# EAGLE design rrfdc (EAGLE 6.4)
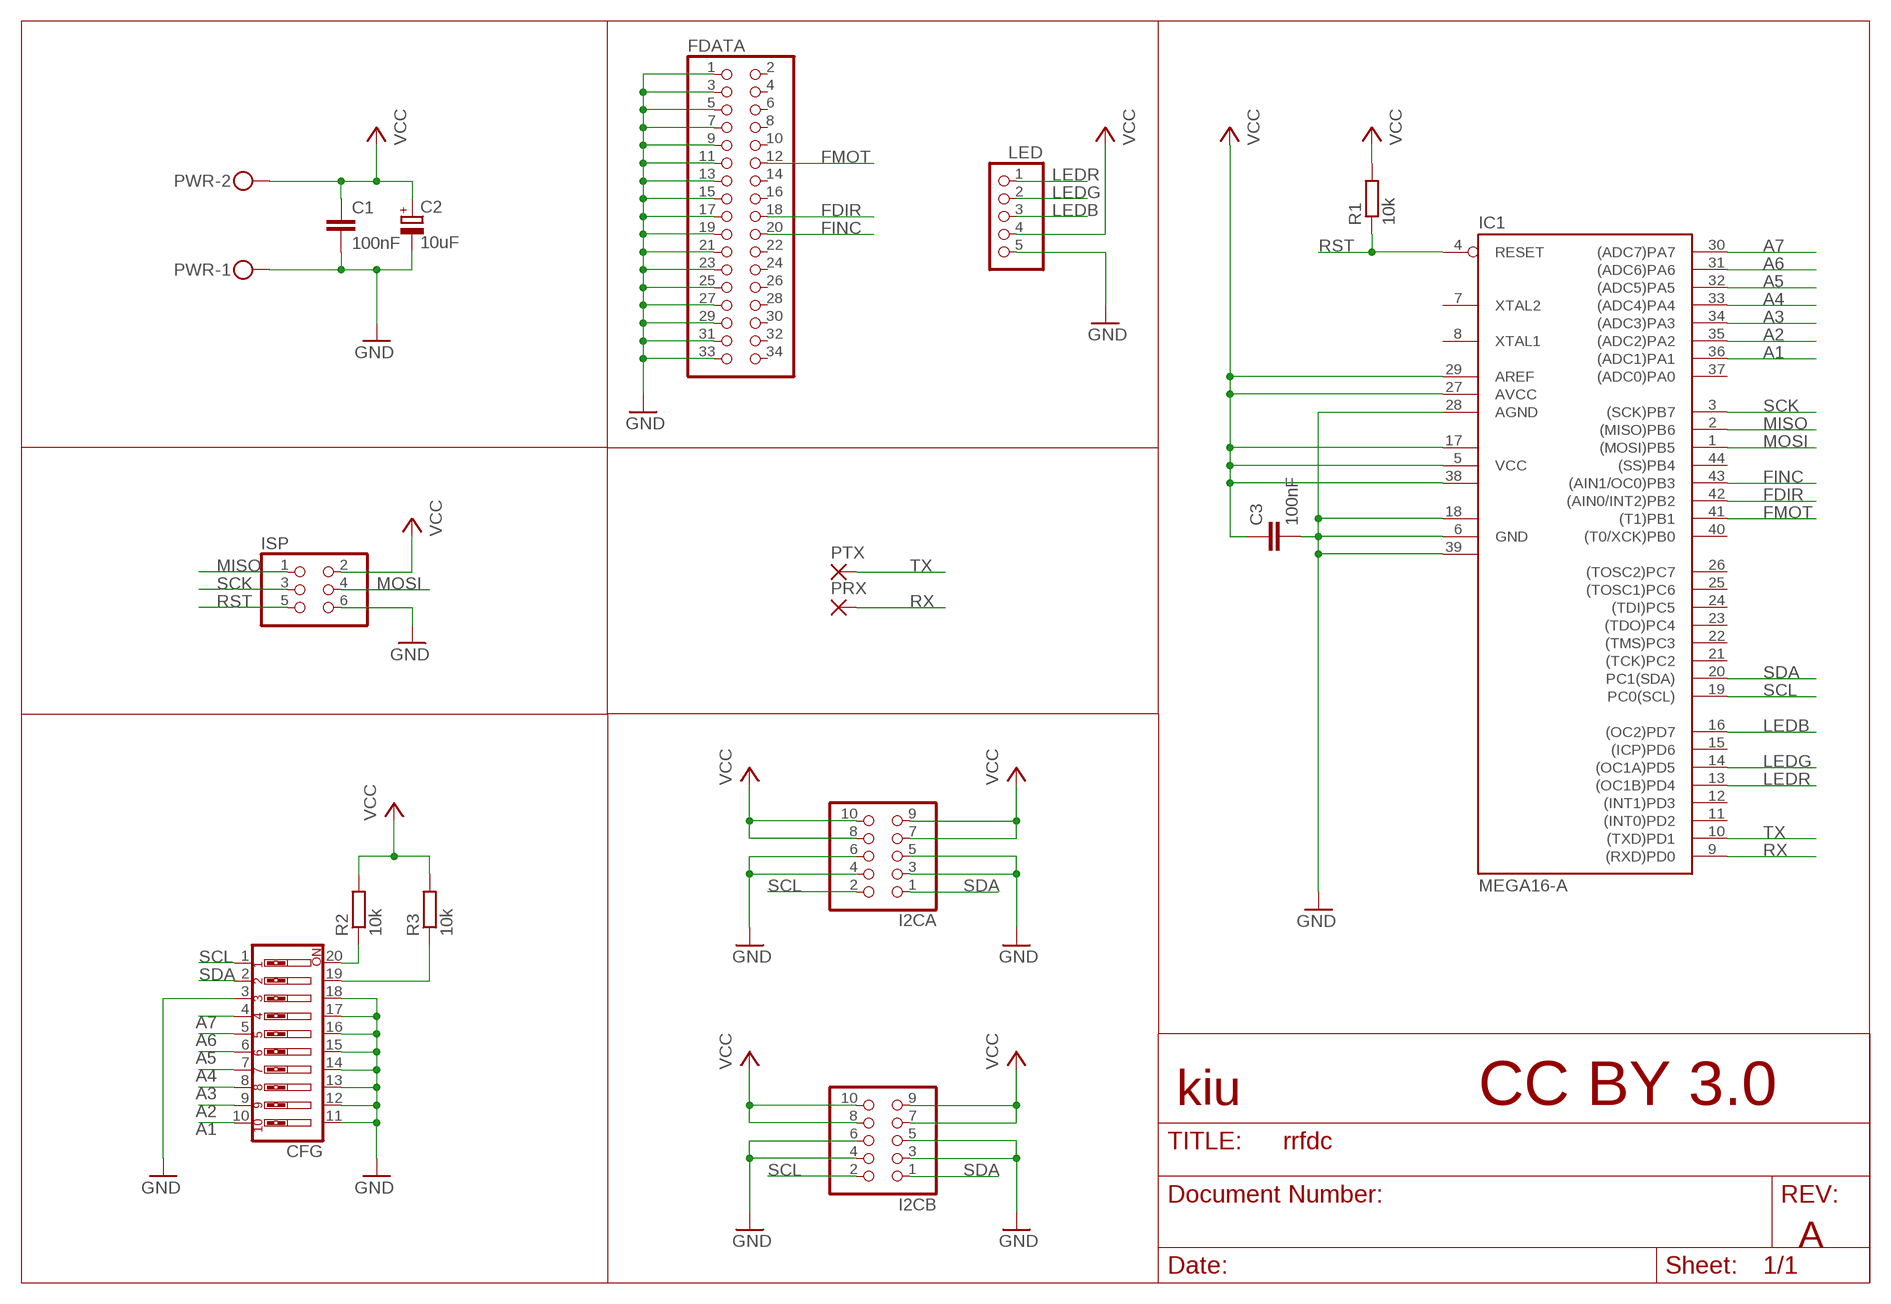
[diagram p0: schematic, sheet 1]

## Parts
C1  100nF  C-EUC0805  [C0805]
C2  10uF  CPOL-EUCT3216  [CT3216]
C3  100nF  C-EUC0805  [C0805]
CFG  SW_DIP-10  [EDG-10]
FDATA  PINHD-2X17  [2X17]
I2CA  PINHD-2X5  [2X05]
I2CB  PINHD-2X5  [2X05]
IC1  MEGA16-A  [TQFP44]
ISP  PINHD-2X3  [2X03]
LED  PINHD-1X5  [1X05]
PRX  SMD2  [SMD1,27-2,54]
PTX  SMD2  [SMD1,27-2,54]
PWR  MKDSN1,5/2-5,08  [MKDSN1,5/2-5,08]
R1  10k  R-EU_R0805  [R0805]
R2  10k  R-EU_R0805  [R0805]
R3  10k  R-EU_R0805  [R0805]

## Nets
A1: CFG.10 IC1.36((ADC1)PA1)
A2: CFG.9 IC1.35((ADC2)PA2)
A3: CFG.8 IC1.34((ADC3)PA3)
A4: CFG.7 IC1.33((ADC4)PA4)
A5: CFG.6 IC1.32((ADC5)PA5)
A6: CFG.5 IC1.31((ADC6)PA6)
A7: CFG.4 IC1.30((ADC7)PA7)
FDIR: FDATA.18 IC1.42((AIN0/INT2)PB2)
FINC: FDATA.20 IC1.43((AIN1/OC0)PB3)
FMOT: FDATA.12 IC1.41((T1)PB1)
GND: C1.2 C2.- C3.2 CFG.3 CFG.11 CFG.12 CFG.13 CFG.14 CFG.15 CFG.16 CFG.17 CFG.18 FDATA.1 FDATA.3 FDATA.5 FDATA.7 FDATA.9 FDATA.11 FDATA.13 FDATA.15 FDATA.17 FDATA.19 FDATA.21 FDATA.23 FDATA.25 FDATA.27 FDATA.29 FDATA.31 FDATA.33 I2CA.3 I2CA.4 I2CA.5 I2CA.6 I2CB.3 I2CB.4 I2CB.5 I2CB.6 IC1.6(GND) IC1.18(GND1) IC1.28(AGND) IC1.39(GND2) ISP.6 LED.5 PWR.1
LEDB: IC1.16((OC2)PD7) LED.3
LEDG: IC1.14((OC1A)PD5) LED.2
LEDR: IC1.13((OC1B)PD4) LED.1
MISO: IC1.2((MISO)PB6) ISP.1
MOSI: IC1.1((MOSI)PB5) ISP.4
N$2: CFG.20 R2.1
N$7: CFG.19 R3.1
RST: IC1.4(RESET) ISP.5 R1.1
RX: IC1.9((RXD)PD0) PRX.1(P)
SCK: IC1.3((SCK)PB7) ISP.3
SCL: CFG.1 I2CA.2 I2CB.2 IC1.19(PC0(SCL))
SDA: CFG.2 I2CA.1 I2CB.1 IC1.20(PC1(SDA))
TX: IC1.10((TXD)PD1) PTX.1(P)
VCC: C1.1 C2.+ C3.1 I2CA.7 I2CA.8 I2CA.9 I2CA.10 I2CB.7 I2CB.8 I2CB.9 I2CB.10 IC1.5(VCC) IC1.17(VCC1) IC1.27(AVCC) IC1.29(AREF) IC1.38(VCC2) ISP.2 LED.4 PWR.2 R1.2 R2.2 R3.2
Unconnected: FDATA.2 FDATA.4 FDATA.6 FDATA.8 FDATA.10 FDATA.14 FDATA.16 FDATA.22 FDATA.24 FDATA.26 FDATA.28 FDATA.30 FDATA.32 FDATA.34 IC1.7(XTAL2) IC1.8(XTAL1) IC1.11((INT0)PD2) IC1.12((INT1)PD3) IC1.15((ICP)PD6) IC1.21((TCK)PC2) IC1.22((TMS)PC3) IC1.23((TDO)PC4) IC1.24((TDI)PC5) IC1.25((TOSC1)PC6) IC1.26((TOSC2)PC7) IC1.37((ADC0)PA0) IC1.40((T0/XCK)PB0) IC1.44((SS)PB4)

## Notes on the sheet
- kiu | CC BY 3.0
- A

## Library data of the parts
C1 C3 = rcl:C-EU: CAPACITOR, European symbol
C2 = rcl:CPOL-EU: POLARIZED CAPACITOR, European symbol
CFG = special:SW_DIP-10: DIP SWITCH
FDATA = pinhead:PINHD-2X17: PIN HEADER
I2CA I2CB = pinhead:PINHD-2X5: PIN HEADER
IC1 = avr:MEGA16: MICROCONTROLLER 16 Kbytes FLASH 1 kbytes SRAM 512 bytes EEPROM USART 8-channel 10 bit ADC
ISP = pinhead:PINHD-2X3: PIN HEADER
LED = pinhead:PINHD-1X5: PIN HEADER
PRX PTX = wirepad:SMD2: SMD PAD
PWR = con-phoenix-508:MKDSN1,5/2-5,08: MKDSN 1,5/ 2-5,08 Printklemme Nennstrom: 13,5 A Nennspannung: 250 V Rastermaß: 5,08 mm Polzahl: 2 Anschlussart: Schraubanschluss Montage: Löten Anschlussrichtung Leiter/Platine: 0 ° Artikelnummer: 1729128 Source: http://eshop.phoenixcontact.com .. 1729128.pdf; MPN: MKDSN 1,5/2-5.08; OC_FARNELL: 1792903; OC_NEWARK: 30M2397
R1-R3 = rcl:R-EU_: RESISTOR, European symbol

## Board
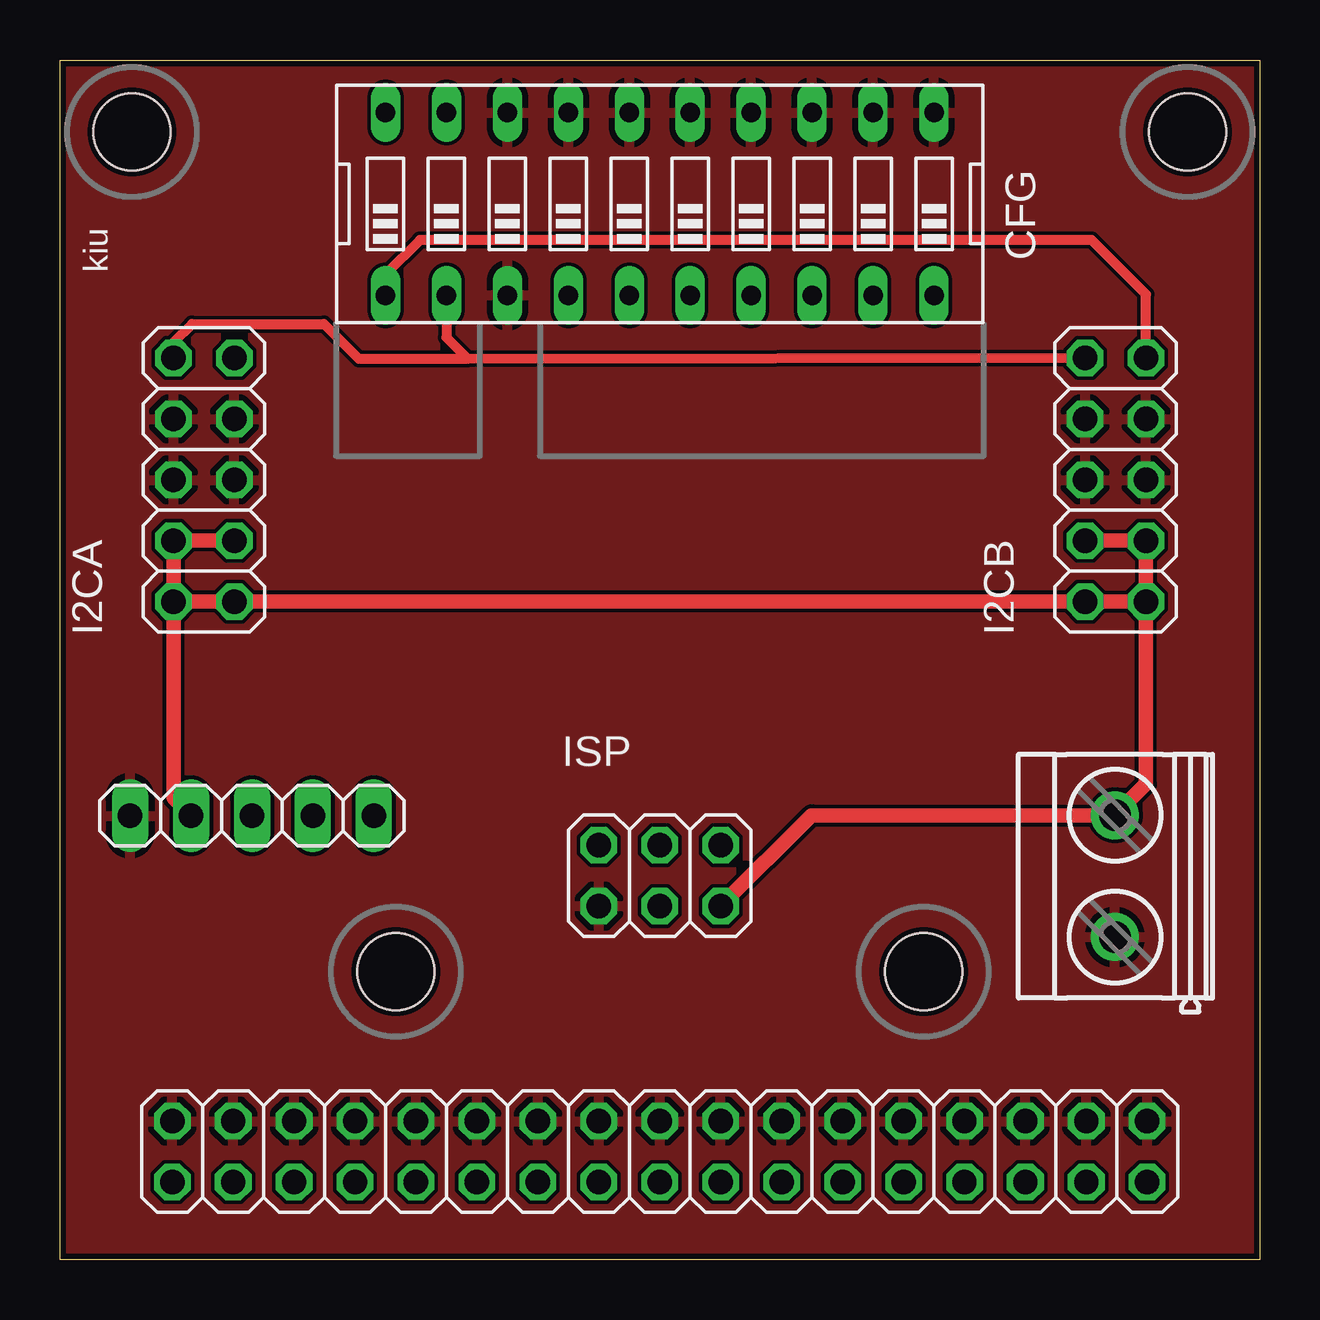
[diagram p1: board, top side]
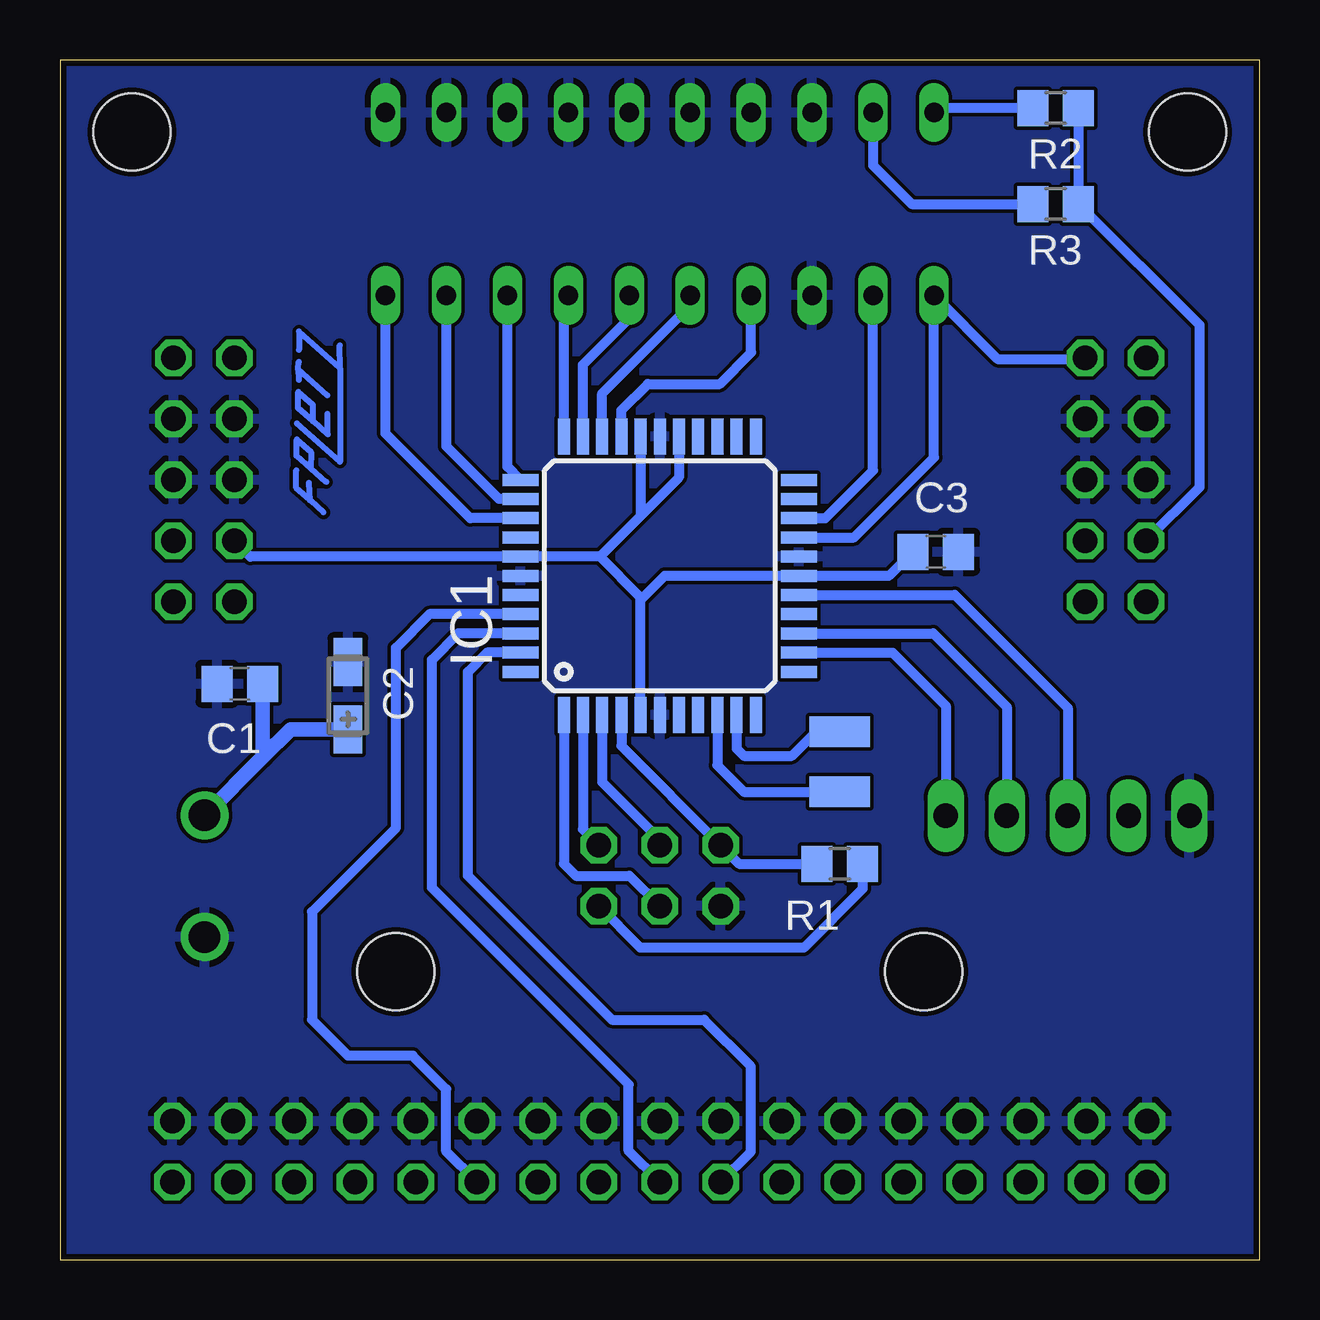
[diagram p2: board, bottom side, seen from below]

Size 50 x 50 mm. Coordinates in mm from the lower left corner, seen from the top.
Outline: 0,0 0,50 50,50 50,0 0,0
Copper layers (1*2*15*16): Top 0.035mm / dielectric 0.2mm / layer 2 0.0175mm / dielectric 1.1mm / layer 15 0.0175mm / dielectric 0.2mm / Bottom 0.035mm
Design rules "SeeedStudio_DRU_no_angle_20130527": minimum track width 6mil, minimum drill 12mil, track to track 6mil, track to pad 6mil, pad to pad 6mil, via to via 6mil, smd to smd 0mil, copper to edge 10mil, drill to drill 10mil, minimum pad ring 6mil, minimum via ring 6mil, stop-mask expansion 2mil, vias tented up to drill 25mil, thermal gap 10mil
Holes 3.2 mm at 3,47 47,47 36,12 14,12

### Footprints (pad centres in the part's own frame; a part is rotated, then mirrored left to right if it is on the bottom)
C0805 = smd 1.3 x 1.5: 1 -0.95,0; 2 0.95,0
CT3216 = smd 2 x 1.2: + -1.4,0; - 1.4,0
EDG-10 = drill 0.813 long: 1 -11.43,-3.81; 2 -8.89,-3.81; 3 -6.35,-3.81; 4 -3.81,-3.81; 5 -1.27,-3.81; 6 1.27,-3.81; 7 3.81,-3.81; 8 6.35,-3.81; 9 8.89,-3.81; 10 11.43,-3.81; 11 11.43,3.81; 12 8.89,3.81; 13 6.35,3.81; 14 3.81,3.81; 15 1.27,3.81; 16 -1.27,3.81; 17 -3.81,3.81; 18 -6.35,3.81; 19 -8.89,3.81; 20 -11.43,3.81
2X17 = drill 1.016 octagon: 1 -20.32,-1.27; 2 -20.32,1.27; 3 -17.78,-1.27; 4 -17.78,1.27; 5 -15.24,-1.27; 6 -15.24,1.27; 7 -12.7,-1.27; 8 -12.7,1.27; 9 -10.16,-1.27; 10 -10.16,1.27; 11 -7.62,-1.27; 12 -7.62,1.27; 13 -5.08,-1.27; 14 -5.08,1.27; 15 -2.54,-1.27; 16 -2.54,1.27; 17 0,-1.27; 18 0,1.27; 19 2.54,-1.27; 20 2.54,1.27; 21 5.08,-1.27; 22 5.08,1.27; 23 7.62,-1.27; 24 7.62,1.27; 25 10.16,-1.27; 26 10.16,1.27; 27 12.7,-1.27; 28 12.7,1.27; 29 15.24,-1.27; 30 15.24,1.27; 31 17.78,-1.27; 32 17.78,1.27; 33 20.32,-1.27; 34 20.32,1.27
2X05 = drill 1.016 octagon: 1 -5.08,-1.27; 2 -5.08,1.27; 3 -2.54,-1.27; 4 -2.54,1.27; 5 0,-1.27; 6 0,1.27; 7 2.54,-1.27; 8 2.54,1.27; 9 5.08,-1.27; 10 5.08,1.27
TQFP44 = smd 1.5 x 0.5: 1 -5.8,4; 2 -5.8,3.2; 3 -5.8,2.4; 4 -5.8,1.6; 5 -5.8,0.8; 6 -5.8,0; 7 -5.8,-0.8; 8 -5.8,-1.6; 9 -5.8,-2.4; 10 -5.8,-3.2; 11 -5.8,-4; 23 5.8,-4; 24 5.8,-3.2; 25 5.8,-2.4; 26 5.8,-1.6; 27 5.8,-0.8; 28 5.8,0; 29 5.8,0.8; 30 5.8,1.6; 31 5.8,2.4; 32 5.8,3.2; 33 5.8,4 | smd 0.5 x 1.5: 12 -4,-5.8; 13 -3.2,-5.8; 14 -2.4,-5.8; 15 -1.6,-5.8; 16 -0.8,-5.8; 17 0,-5.8; 18 0.8,-5.8; 19 1.6,-5.8; 20 2.4,-5.8; 21 3.2,-5.8; 22 4,-5.8; 34 4,5.8; 35 3.2,5.8; 36 2.4,5.8; 37 1.6,5.8; 38 0.8,5.8; 39 0,5.8; 40 -0.8,5.8; 41 -1.6,5.8; 42 -2.4,5.8; 43 -3.2,5.8; 44 -4,5.8
2X03 = drill 1.016 octagon: 1 -2.54,-1.27; 2 -2.54,1.27; 3 0,-1.27; 4 0,1.27; 5 2.54,-1.27; 6 2.54,1.27
1X05 = drill 1.016 long: 1 -5.08,0; 2 -2.54,0; 3 0,0; 4 2.54,0; 5 5.08,0
SMD1,27-2,54 = smd 1.27 x 2.54: 1 0,0
MKDSN1,5/2-5,08 = drill 1.3 pad 2: 1 -2.561,0.025; 2 2.519,0.025
R0805 = smd 1.3 x 1.5: 1 -0.95,0; 2 0.95,0

### Placement (x,y rotation side)
C1  42.5,24 180 bottom
C2  38,23.5 90 bottom
C3  13.5,29.5 0 bottom
CFG  25,44 0 top
FDATA  25,4.5 180 top
I2CA  6,32.5 270 top
I2CB  44,32.5 270 top
IC1  25,28.5 90 bottom
ISP  25,16 180 top
LED  8,18.5 180 top
PRX  17.5,19.5 90 bottom
PTX  17.5,22 90 bottom
PWR  44,16 90 top
R1  17.5,16.5 0 bottom
R2  8.5,48 0 bottom
R3  8.5,44 0 bottom

### Tracks (layer width: path | path; a pad name or v marks a point on that pad's centre or on a via)
A1
  Bottom 0.406: IC1.36 32.9,30.9 36.43,34.43 CFG.10
A2
  Bottom 0.406: IC1.35 31.7,31.7 33.89,33.89 CFG.9
A3
  Bottom 0.406: IC1.34 31.35,33.05 CFG.8
A4
  Bottom 0.406: IC1.33 29,40 CFG.7
A5
  Bottom 0.406: IC1.32 28.2,37.3 26.27,39.23 CFG.6
A6
  Bottom 0.406: IC1.31 27.4,36.1 23.73,39.77 CFG.5
A7
  Bottom 0.406: IC1.30 26.6,35.4 25.5,36.5 22.5,36.5 21.19,37.81 CFG.4
FDIR
  Bottom 0.406: IC1.42 33.4,26.1 34.5,25 34.5,15.5 26.3,7.3 26.3,4.53 FDATA.18
FINC
  Bottom 0.406: IC1.43 32.2,25.3 33,24.5 33,16 27,10 23.15,10 21.2,8.05 21.2,4.49 FDATA.20
FMOT
  Bottom 0.406: IC1.41 34.6,26.9 36,25.5 36,18 39.5,14.5 39.5,10 38,8.5 35.3,8.5 33.9,7.1 33.9,4.51 FDATA.12
GND
  pour Top: -0.5,50.5 50.5,50.5 50.5,-0.5 -0.5,-0.5
  pour Bottom: -0.5,50.5 50.5,50.5 50.5,-0.5 -0.5,-0.5
LEDB
  Bottom 0.406: IC1.16 12.7,27.7 8,23 LED.3
LEDG
  Bottom 0.406: IC1.14 13.6,26.1 10.54,23.04 LED.2
LEDR
  Bottom 0.406: IC1.13 15.3,25.3 13.08,23.08 LED.1
MISO
  Bottom 0.406: IC1.2 28.2,17.93 ISP.1
MOSI
  Bottom 0.406: IC1.1 29,16.5 28.5,16 26.27,16 ISP.4
N$2
  Bottom 0.406: R2.1 13.38,48 CFG.20
N$7
  Bottom 0.406: CFG.19 16.11,45.61 14.5,44 R3.1
N$28
  Bottom 0.254: 39.52,32.96 40.14,33.51 40.13,34.18 39.52,33.63 39.52,32.96 | 38.91,32.41 39.52,32.96
N$29
  Bottom 0.254: 40.13,34.86 38.33,33.25 38.33,37.17 | 40.03,37.92 40.03,38.69 38.33,37.17 | 38.33,37.17 38.34,38.11
N$30
  Bottom 0.254: 38.84,35.25 38.84,34.39 39.46,34.94 | 39.46,34.94 40.07,35.49 40.07,36.17 39.45,35.62 39.46,34.94
N$31
  Bottom 0.254: 40.15,32.9 40.15,32.16 39.58,31.65 | 39.58,31.65 39.01,31.14 | 39.58,31.65 39.62,32.37
N$32
  Bottom 0.254: 40.08,37.11 40.05,36.66 | 38.84,36.01 40.08,37.11 | 40.08,37.11 40.05,37.43
RST
  Bottom 0.406: IC1.4 26.6,21.41 ISP.5 21.69,16.5 R1.1
RX
  Bottom 0.406: IC1.9 22.6,20.6 21.5,19.5 PRX.1
SCK
  Bottom 0.406: IC1.3 27.4,19.9 25,17.5 ISP.3
SCL
  Top 0.406: I2CB.2 45.27,40.23 43,42.5 15,42.5 13.57,41.07 CFG.1
  Bottom 0.406: IC1.19 16.9,30.1 13.57,33.43 CFG.1 10.92,37.54 7.31,37.54 I2CA.2
SDA
  Top 0.406: I2CB.1 17,37.54 | 17,37.54 12.46,37.54 11,39 5.5,39 4.73,38.23 I2CA.1 | CFG.2 16.11,38.43 17,37.54
  Bottom 0.406: IC1.20 18.1,30.9 16.11,32.89 CFG.2
TX
  Bottom 0.406: IC1.10 21.8,21.3 21.5,21 19.5,21 18.5,22 PTX.1
VCC
  Top 0.61: I2CB.7 I2CB.8 I2CB.10 | I2CA.8 I2CA.7 I2CA.9 | ISP.2 31.33,18.52 PWR.2 45.27,19.81 I2CB.10 | I2CA.9 I2CA.10 I2CB.9 I2CB.10 | LED.4 4.73,19.23 I2CA.9
  Bottom 0.406: IC1.17 19.16,28.46 | 27.5,29.3 IC1.38 42.07,29.3 I2CB.7 | IC1.29 25.8,31 | IC1.27 24.2,32.6 25.8,31 | C3.1 15.45,28.5 IC1.17 | IC1.5 25.8,27.5 | 25.8,27.5 25.8,27.6 27.5,29.3 | 27.5,29.3 25.8,31 | R2.2 R3.2 2.5,38.95 2.5,32.19 I2CA.7 | R1.2 16.55,15.45 19,13 25.81,13 ISP.2 | IC1.17 24.8,28.5 25.8,27.5
  Bottom 0.61: PWR.2 41.55,20.94 | 41.55,20.94 C1.1 | C2.+ 40.39,22.1 41.55,20.94

### Text on the board
tNames: kiu
tDocu: TRM | A7 | A6 | A5 | A4 | A3 | A2 | A1 | RRFDC REV A | B | G | R | - | + | +5V | PWR